# EAGLE design RJ12_senzor (EAGLE 7.4.0)
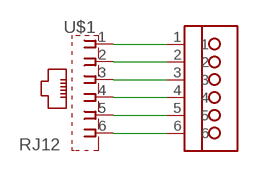
[diagram p0: schematic, sheet 1]

## Parts
U$1  RJ12  [RJ12]
U$2  CON_SENSOR  [CON_SENSOR]

## Nets
GND: U$1.1 U$2.1
N$2: U$1.2 U$2.2
N$3: U$1.3 U$2.3
N$4: U$1.4 U$2.4
N$5: U$1.5 U$2.5
N$6: U$1.6 U$2.6

## Library data of the parts
U$1 = AtoG:RJ12
U$2 = AtoG:CON_SENSOR

## Board
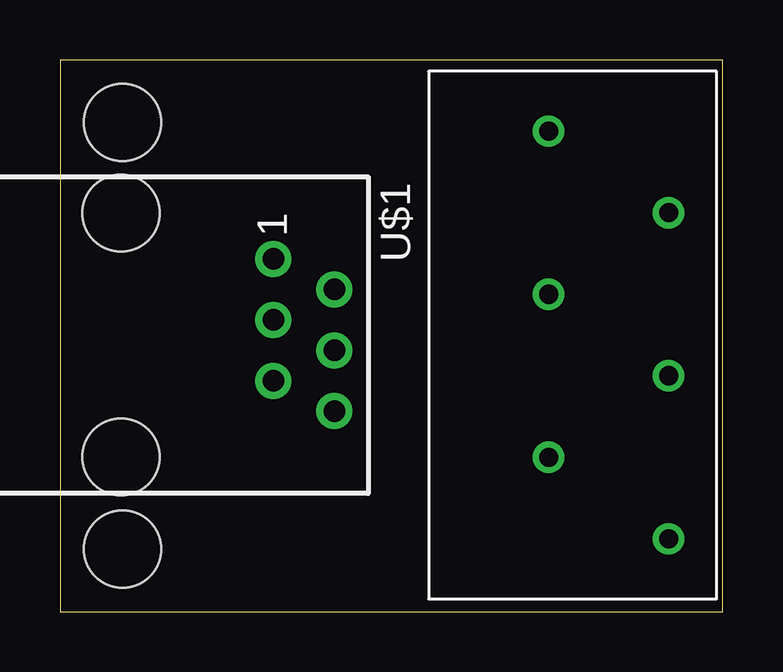
[diagram p1: board, top side]
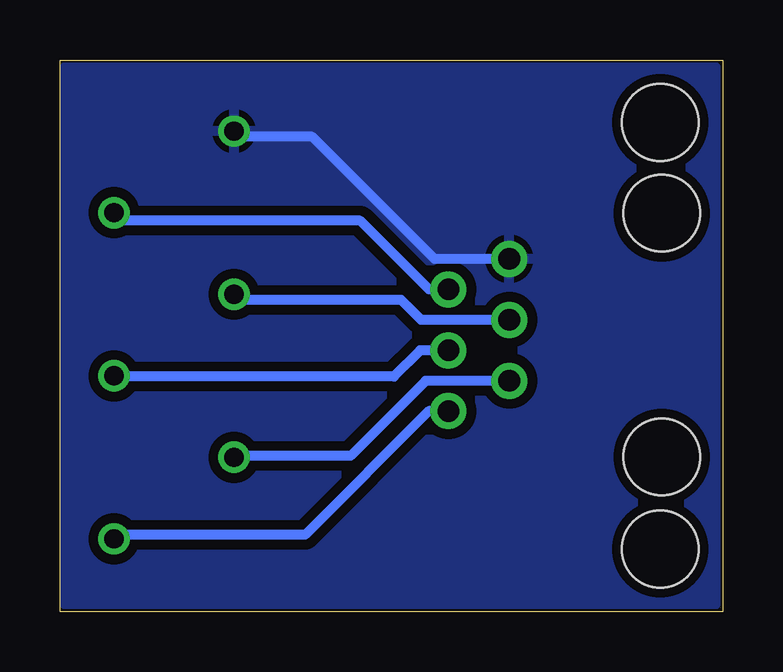
[diagram p2: board, bottom side, seen from below]

Size 27.61 x 23 mm. Coordinates in mm from the lower left corner, seen from the top.
Outline: 0,0 27.61,0 27.61,23 0,23 0,0
Copper layers (1*16): Top 0.035mm / dielectric 1.5mm / Bottom 0.035mm
Design rules "default *": minimum track width 10mil, minimum drill 24mil, track to track 8mil, track to pad 8mil, pad to pad 8mil, via to via 8mil, smd to smd 8mil, copper to edge 0mil, drill to drill 8mil, minimum pad ring 10mil, minimum via ring 8mil, stop-mask expansion 4mil, vias tented up to drill 0mil, thermal gap 10mil
Holes 3.2 mm at 2.6,20.4 2.6,2.6

### Footprints (pad centres in the part's own frame; a part is rotated, then mirrored left to right if it is on the bottom)
RJ12 = drill 0.9 pad 1.5: 1 -3.175,6.35; 2 -1.905,8.89; 3 -0.635,6.35; 4 0.635,8.89; 5 1.905,6.35; 6 3.175,8.89 | hole 3.2: -5.08,0; 5.08,0
CON_SENSOR = drill 0.8: 1 -8.5,-2.5; 2 -5.1,2.5; 3 -1.7,-2.5; 4 1.7,2.5; 5 5.1,-2.5; 6 8.5,2.5

### Placement (x,y rotation side)
U$1  2.54,11.53 270 top
U$2  22.86,11.53 270 top

### Tracks (layer width: path | path; a pad name or v marks a point on that pad's centre or on a via)
GND
  Bottom 0.406: U$1.1 12.01,14.71 17.1,19.8 20.13,19.8 U$2.1
  pour Bottom (isolate 0.406): 0.3,22.7 0.3,0.3 27.4,0.3 27.4,22.7
N$2
  Bottom 0.406: U$1.2 12.23,13.44 15.1,16.3 25.03,16.3 U$2.2
N$3
  Bottom 0.406: U$1.3 12.56,12.16 13.4,13 20.13,13 U$2.3
N$4
  Bottom 0.406: U$1.4 12.61,10.89 13.7,9.8 25.33,9.8 U$2.4
N$5
  Bottom 0.406: U$1.5 12.38,9.62 15.5,6.5 20.29,6.5 U$2.5
N$6
  Bottom 0.406: U$1.6 12.24,8.36 17.4,3.2 25.19,3.2 U$2.6